# Altium schematic sheet РЕУН.468332.001_Connectors.SchDoc: =Name-1str
size 420 x 297 mm; SheetNumber: 6; Вид изделия: Документация; Раздел: Документация; Код документа: Э3; Вид документа: Схема электрическая принципиальная; Класс документа: Конструкторский документ; Создавать изделие в PLM: Yes; DocumentCode: РЕУН.468332.001 Э3 2D; DocumentView: Схема электрическая принципиальная; DocumentClass: Конструкторский документ; ProductView: Документация; Format: А3
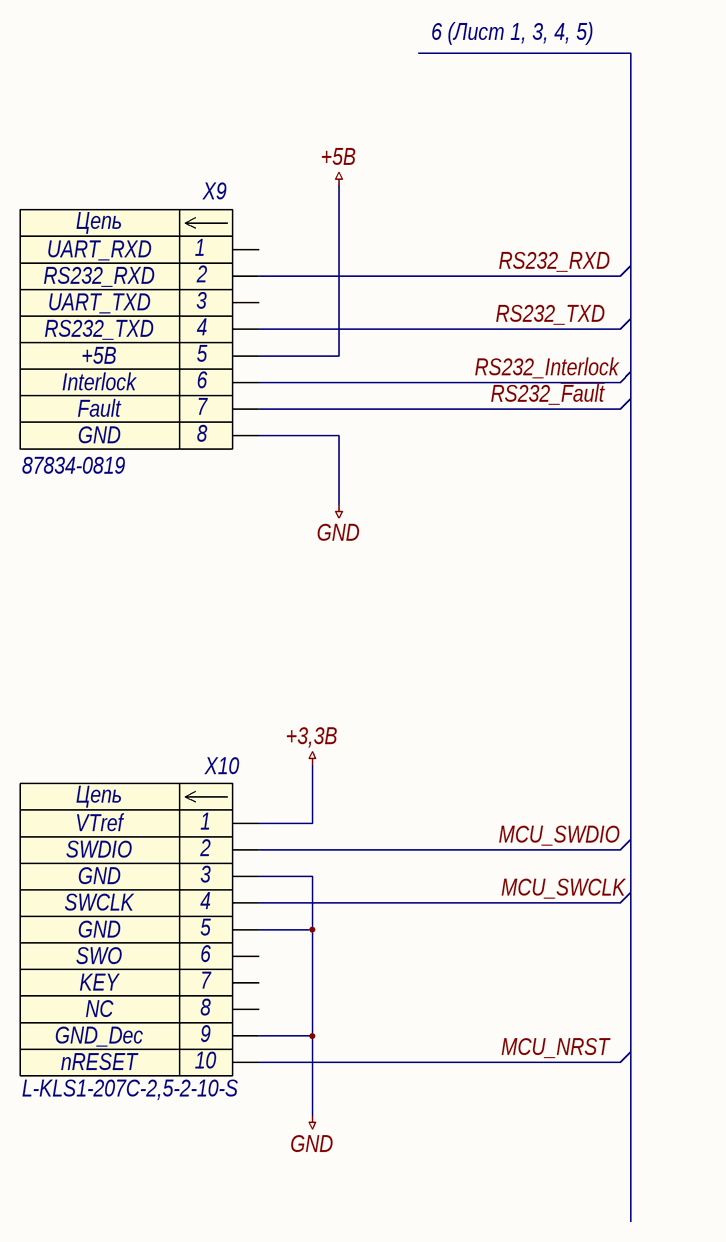
[diagram p0: РЕУН.468332.001_Connectors.SchDoc]

## Parts
X9  87834-0819
X10  L-KLS1-207C-2,5-2-10-S

## Nets
+3,3В: X10.1
+5В: X9.5
GND: X9.8 X10.3 X10.5 X10.9
MCU_NRST: X10.10
MCU_SWCLK: X10.4
MCU_SWDIO: X10.2
RS232_~{Fault}: X9.7
RS232_Interlock: X9.6
RS232_RXD: X9.2
RS232_TXD: X9.4

Not connected (* = marked no-connect by the designer): X9 1 3; X10 6 7 8

## Notes on the sheet
- 6 (Лист 1, 3, 4, 5)
- Подп. и дата
- Инв. № дубл.
- Взам. инв. №
- Инв. № подл.
- Лист
- Изм.
- № докум.
- Подп.
- Дата
- Копировал
- Формат
- (in symbol x8-m) Цепь
- (in symbol x10-m) Цепь

## Library data of the parts
X9 = x8-m: Разъем - 8 конт. вилка; Contact_1: UART_RXD; Contact_2: RS232_RXD; Contact_3: UART_TXD; Contact_4: RS232_TXD; Contact_5: +5В; Contact_6: Interlock; Contact_7: Fault; Contact_8: GND; Name: 87834-0819
X10 = x10-m: Разъем - 10 конт. вилка; Contact_1: VTref; Contact_2: SWDIO; Contact_3: GND; Contact_4: SWCLK; Contact_6: SWO; Contact_7: KEY; Contact_8: NC; Contact_9: GND_Dec; Contact_10: nRESET; Contact_5: GND; Name: L-KLS1-207C-2,5-2-10-S